# EAGLE schematic General IO (EAGLE 7.4.0)
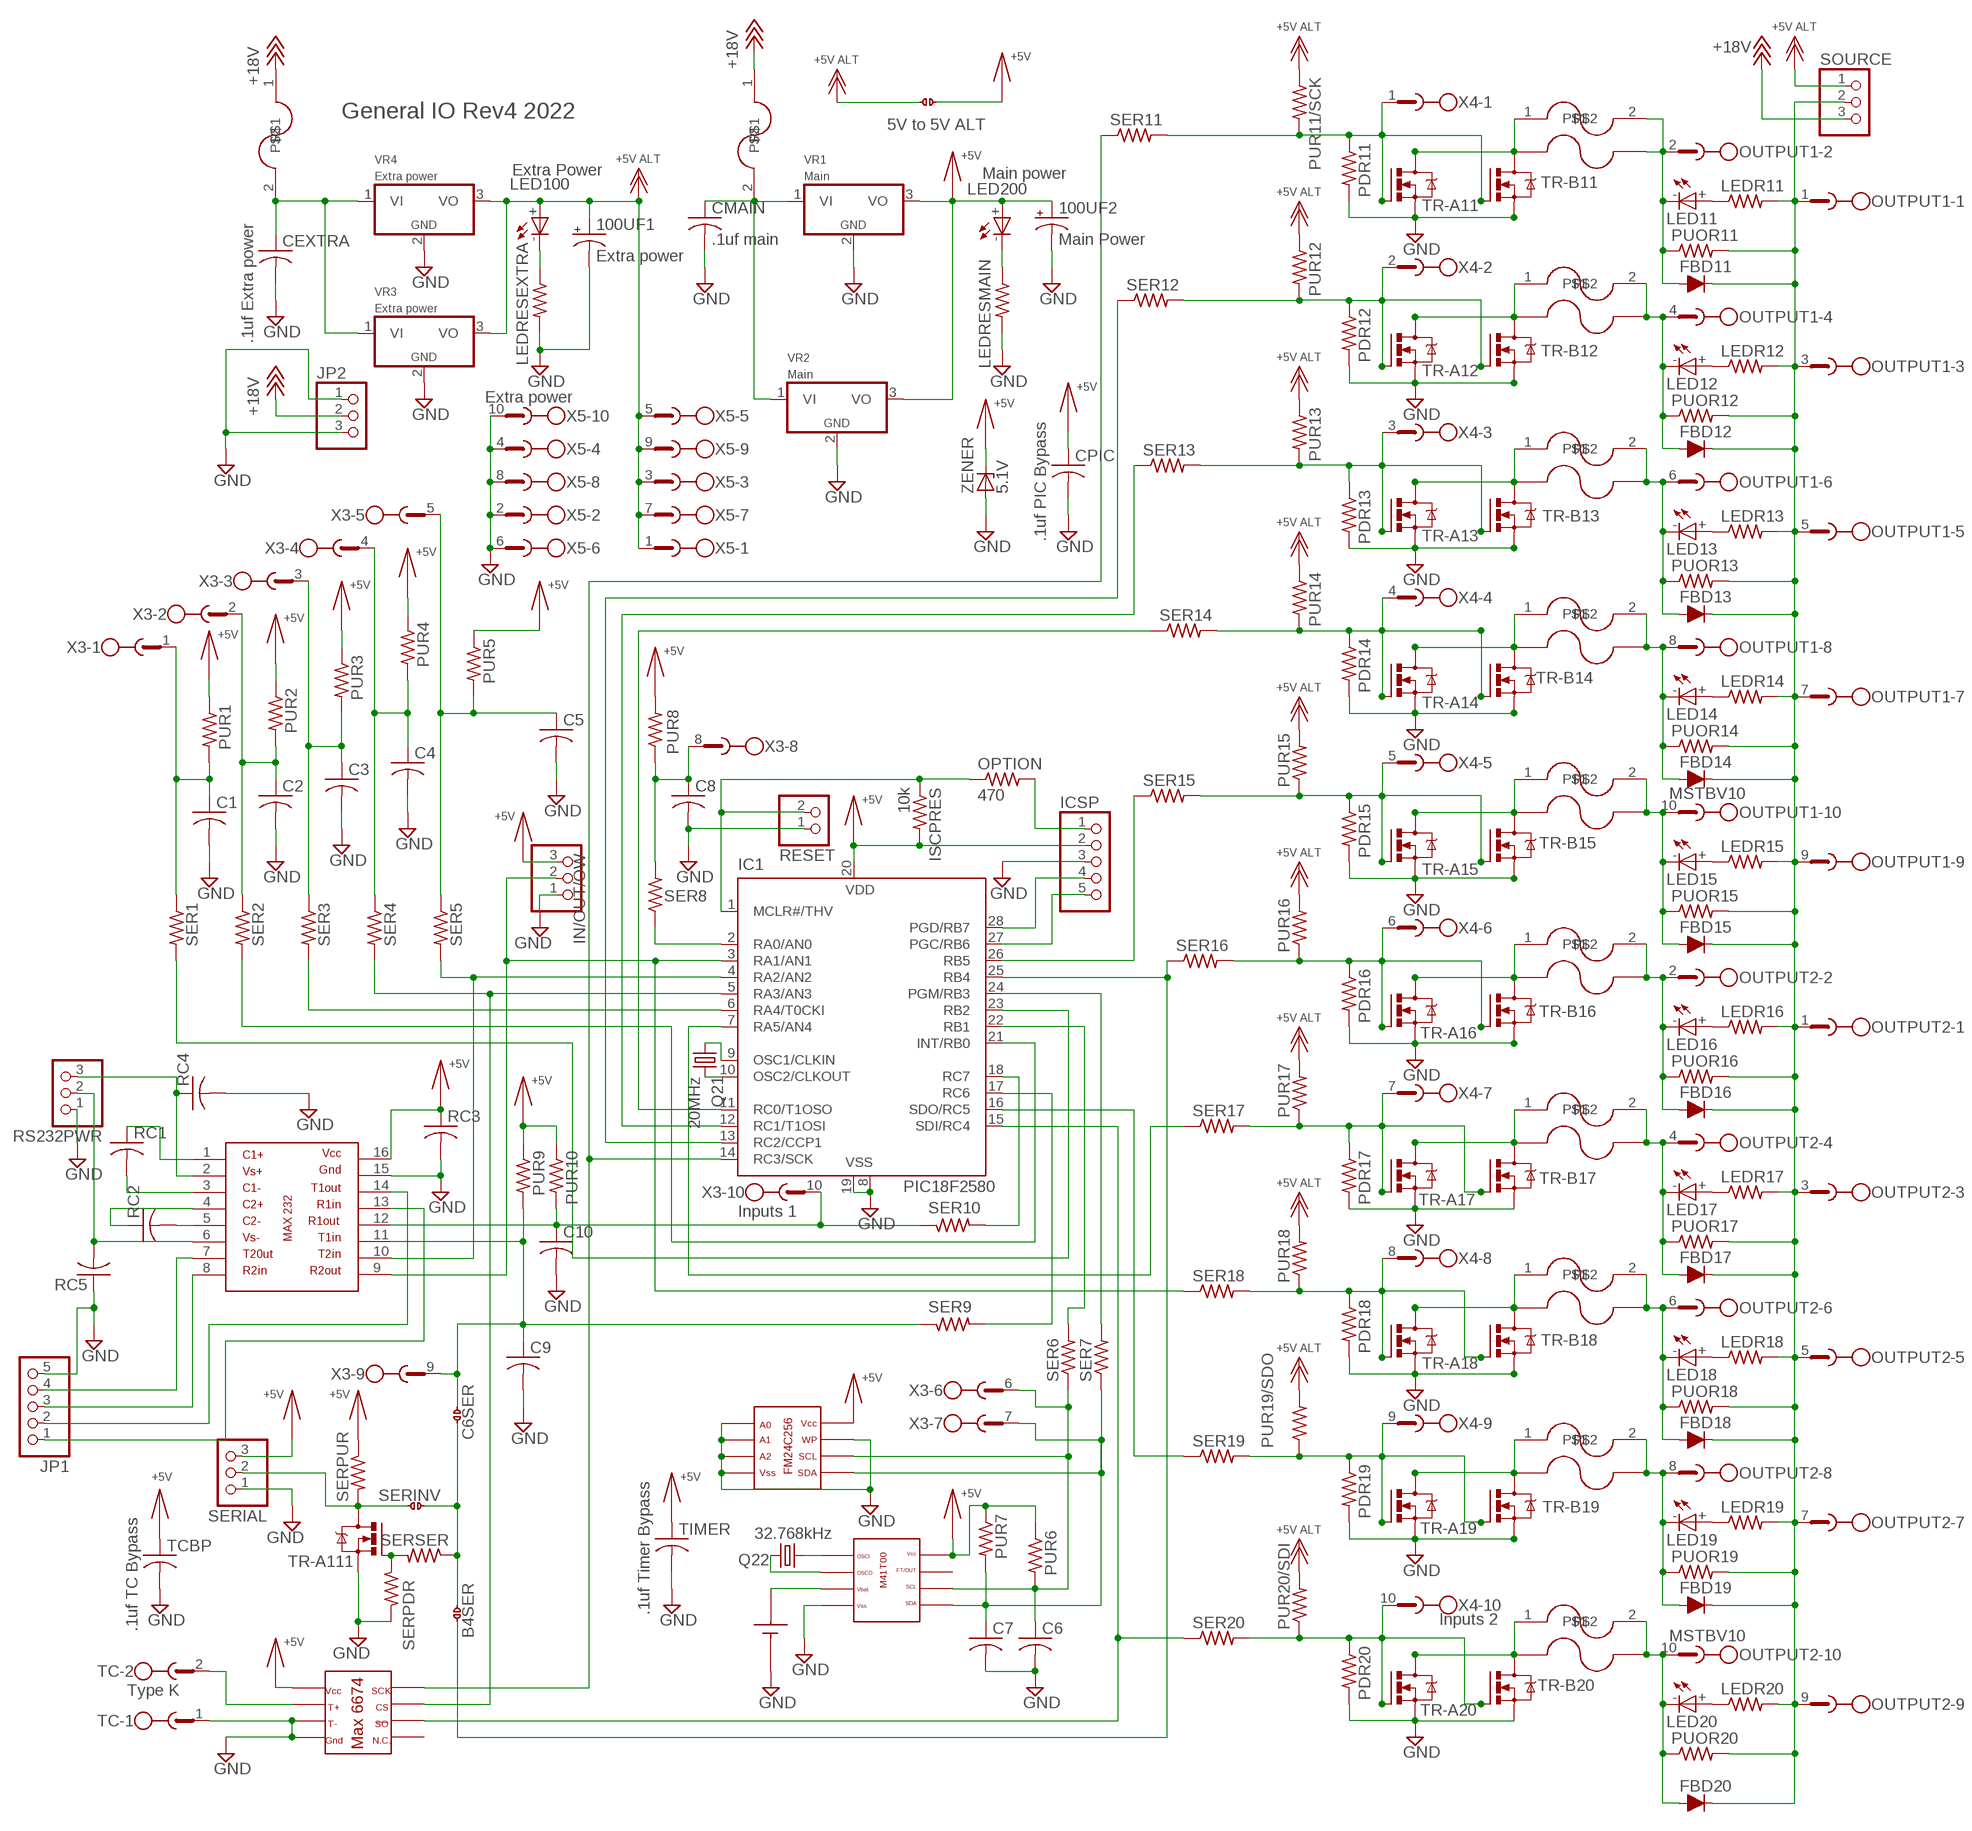
[diagram p0: schematic, sheet 1]

## Parts
100UF1  Extra power  CAPACITOR-ELECTROLYTICG  [PANASONIC_G]
100UF2  Main Power  CAPACITOR-ELECTROLYTICG  [PANASONIC_G]
BAT1  BH-401  [BH-401]
C1  CAPACITOR-NO-POLARITYC1210  [C1210]
C2  CAPACITOR-NO-POLARITYC1210  [C1210]
C3  CAPACITOR-NO-POLARITYC1210  [C1210]
C4  CAPACITOR-NO-POLARITYC1210  [C1210]
C5  CAPACITOR-NO-POLARITYC1210  [C1210]
C6  CAPACITOR-NO-POLARITYC1210  [C1210]
C6SER  SPLIT_PAD  [SPLIT_PAD]
C7  CAPACITOR-NO-POLARITYC1210  [C1210]
C8  CAPACITOR-NO-POLARITYC1210  [C1210]
C9  CAPACITOR-NO-POLARITYC1210  [C1210]
C10  CAPACITOR-NO-POLARITYC1210  [C1210]
CEXTRA  .1uf Extra power  CAPACITOR-NO-POLARITYC1210  [C1210]
CMAIN  .1uf main  CAPACITOR-NO-POLARITYC1210  [C1210]
CPIC  .1uf PIC Bypass  CAPACITOR-NO-POLARITYC1210  [C1210]
FBD11  D-FILL-SOD-87  [SOD87]
FBD12  D-FILL-SOD-87  [SOD87]
FBD13  D-FILL-SOD-87  [SOD87]
FBD14  D-FILL-SOD-87  [SOD87]
FBD15  D-FILL-SOD-87  [SOD87]
FBD16  D-FILL-SOD-87  [SOD87]
FBD17  D-FILL-SOD-87  [SOD87]
FBD18  D-FILL-SOD-87  [SOD87]
FBD19  D-FILL-SOD-87  [SOD87]
FBD20  D-FILL-SOD-87  [SOD87]
FUSE9  FUSE(SM)  [FUSE]
FUSE11  FUSE(SM)  [FUSE]
FUSE12  FUSE(SM)  [FUSE]
FUSE13  FUSE(SM)  [FUSE]
FUSE14  FUSE(SM)  [FUSE]
FUSE15  FUSE(SM)  [FUSE]
FUSE16  FUSE(SM)  [FUSE]
FUSE17  FUSE(SM)  [FUSE]
FUSE18  FUSE(SM)  [FUSE]
FUSE20  FUSE(SM)  [FUSE]
IC1  PIC18F2580  PIC16F876SO  [SO-28W]
ICSP  PINHD-1X5  [1X05]
IN/OUT/OW  PINHD-1X3  [1X03]
ISCPRES  10k  RESISITORM1406  [M1406]
JP1  PINHD-1X5  [1X05]
JP2  PINHD-1X3  [1X03]
LED11  LED  [1206]
LED12  LED  [1206]
LED13  LED  [1206]
LED14  LED  [1206]
LED15  LED  [1206]
LED16  LED  [1206]
LED17  LED  [1206]
LED18  LED  [1206]
LED19  LED  [1206]
LED20  LED  [1206]
LED100  Extra Power  LED  [1206]
LED200  Main power  LED  [1206]
LEDR11  RESISITORM1406  [M1406]
LEDR12  RESISITORM1406  [M1406]
LEDR13  RESISITORM1406  [M1406]
LEDR14  RESISITORM1406  [M1406]
LEDR15  RESISITORM1406  [M1406]
LEDR16  RESISITORM1406  [M1406]
LEDR17  RESISITORM1406  [M1406]
LEDR18  RESISITORM1406  [M1406]
LEDR19  RESISITORM1406  [M1406]
LEDR20  RESISITORM1406  [M1406]
LEDRESEXTRA  RESISITORR1210  [R1210]
LEDRESMAIN  RESISITORR1210  [R1210]
OPTION  470  RESISITORM1406  [M1406]
OUTPUT1  MSTBV10  [MSTBV10]
OUTPUT2  MSTBV10  [MSTBV10]
PDR11  RESISITORM1406  [M1406]
PDR12  RESISITORM1406  [M1406]
PDR13  RESISITORM1406  [M1406]
PDR14  RESISITORM1406  [M1406]
PDR15  RESISITORM1406  [M1406]
PDR16  RESISITORM1406  [M1406]
PDR17  RESISITORM1406  [M1406]
PDR18  RESISITORM1406  [M1406]
PDR19  RESISITORM1406  [M1406]
PDR20  RESISITORM1406  [M1406]
POLYFUSE11  POLYFUSE  [0204/5]
POLYFUSE12  POLYFUSE  [0204/5]
POLYFUSE13  POLYFUSE  [0204/5]
POLYFUSE14  POLYFUSE  [0204/5]
POLYFUSE15  POLYFUSE  [0204/5]
POLYFUSE16  POLYFUSE  [0204/5]
POLYFUSE17  POLYFUSE  [0204/5]
POLYFUSE18  POLYFUSE  [0204/5]
POLYFUSE19  POLYFUSE  [0204/5]
POLYFUSE20  POLYFUSE  [0204/5]
POLYFUSE100  Extra Power  POLYFUSE  [0204/5]
POLYFUSE200  Main power  POLYFUSE  [0204/5]
PUOR11  RESISITORM1406  [M1406]
PUOR12  RESISITORM1406  [M1406]
PUOR13  RESISITORM1406  [M1406]
PUOR14  RESISITORM1406  [M1406]
PUOR15  RESISITORM1406  [M1406]
PUOR16  RESISITORM1406  [M1406]
PUOR17  RESISITORM1406  [M1406]
PUOR18  RESISITORM1406  [M1406]
PUOR19  RESISITORM1406  [M1406]
PUOR20  RESISITORM1406  [M1406]
PUR1  RESISITORM1406  [M1406]
PUR2  RESISITORM1406  [M1406]
PUR3  RESISITORM1406  [M1406]
PUR4  RESISITORM1406  [M1406]
PUR5  RESISITORM1406  [M1406]
PUR6  RESISITORM1406  [M1406]
PUR7  RESISITORM1406  [M1406]
PUR8  RESISITORM1406  [M1406]
PUR9  RESISITORM1406  [M1406]
PUR10  RESISITORM1406  [M1406]
PUR11/SCK  RESISITORM1406  [M1406]
PUR12  RESISITORM1406  [M1406]
PUR13  RESISITORM1406  [M1406]
PUR14  RESISITORM1406  [M1406]
PUR15  RESISITORM1406  [M1406]
PUR16  RESISITORM1406  [M1406]
PUR17  RESISITORM1406  [M1406]
PUR18  RESISITORM1406  [M1406]
PUR19/SDO  RESISITORM1406  [M1406]
PUR20/SDI  RESISITORM1406  [M1406]
Q21  20MHz  CRYSTALSM49  [SM49]
Q22  32.768kHz  CRYSTALTC26H  [TC26H]
RC1  CAPACITOR-NO-POLARITYC1210  [C1210]
RC2  CAPACITOR-NO-POLARITYC1210  [C1210]
RC3  CAPACITOR-NO-POLARITYC1210  [C1210]
RC4  CAPACITOR-NO-POLARITYC1210  [C1210]
RC5  CAPACITOR-NO-POLARITYC1210  [C1210]
RESET  PINHD-1X2  [1X02]
RS232PWR  PINHD-1X3  [1X03]
SER1  RESISITORM1406  [M1406]
SER2  RESISITORM1406  [M1406]
SER3  RESISITORM1406  [M1406]
SER4  RESISITORM1406  [M1406]
SER5  RESISITORM1406  [M1406]
SER6  RESISITORM1406  [M1406]
SER7  RESISITORM1406  [M1406]
SER8  RESISITORM1406  [M1406]
SER9  RESISITORM1406  [M1406]
SER10  RESISITORM1406  [M1406]
SER11  RESISITORM1406  [M1406]
SER12  RESISITORM1406  [M1406]
SER13  RESISITORM1406  [M1406]
SER14  RESISITORM1406  [M1406]
SER15  RESISITORM1406  [M1406]
SER16  RESISITORM1406  [M1406]
SER17  RESISITORM1406  [M1406]
SER18  RESISITORM1406  [M1406]
SER19  RESISITORM1406  [M1406]
SER20  RESISITORM1406  [M1406]
SERIAL  PINHD-1X3  [1X03]
SERPDR  RESISITORM1406  [M1406]
SERPUR  RESISITORM1406  [M1406]
SERSER  RESISITORM1406  [M1406]
SOURCE  PINHD-1X3  [1X03]
TC  Type K  MST2V  [MSTBV2]
TCBP  .1uf TC Bypass  CAPACITOR-NO-POLARITYC1210  [C1210]
TIMER  .1uf Timer Bypass  CAPACITOR-NO-POLARITYC1210  [C1210]
TR-A11  ZXMN10A08GSOT223  [SOT223R_INFINEON]
TR-A12  ZXMN10A08GSOT223  [SOT223R_INFINEON]
TR-A13  ZXMN10A08GSOT223  [SOT223R_INFINEON]
TR-A14  ZXMN10A08GSOT223  [SOT223R_INFINEON]
TR-A15  ZXMN10A08GSOT223  [SOT223R_INFINEON]
TR-A16  ZXMN10A08GSOT223  [SOT223R_INFINEON]
TR-A17  ZXMN10A08GSOT223  [SOT223R_INFINEON]
TR-A18  ZXMN10A08GSOT223  [SOT223R_INFINEON]
TR-A19  ZXMN10A08GSOT223  [SOT223R_INFINEON]
TR-A20  ZXMN10A08GSOT223  [SOT223R_INFINEON]
TR-A111  ZXMN10A08GSOT223  [SOT223R_INFINEON]
TR-B11  ZXMN10A08G  [TO220BV]
TR-B12  ZXMN10A08G  [TO220BV]
TR-B13  ZXMN10A08G  [TO220BV]
TR-B14  ZXMN10A08G  [TO220BV]
TR-B15  ZXMN10A08G  [TO220BV]
TR-B16  ZXMN10A08G  [TO220BV]
TR-B17  ZXMN10A08G  [TO220BV]
TR-B18  ZXMN10A08G  [TO220BV]
TR-B19  ZXMN10A08G  [TO220BV]
TR-B20  ZXMN10A08G  [TO220BV]
U$1  MAX232  [SO16]
U$2  MAX6674  [SO08]
U$4  M41T00TIMER-I2C  [SO08]
U$18  FM24C256  [SO08]
U$21  SPLIT_PAD  [SPLIT_PAD]
U$23  SPLIT_PAD  [SPLIT_PAD]
U$24  SPLIT_PAD  [SPLIT_PAD]
VR1  Main  VOLTAGE-REGULATOR  [TO220S]
VR2  Main  VOLTAGE-REGULATORSO-223  [SOT223R_INFINEON]
VR3  Extra power  VOLTAGE-REGULATORSO-223  [SOT223R_INFINEON]
VR4  Extra power  VOLTAGE-REGULATOR  [TO220S]
X3  Inputs 1  MSTBV10  [MSTBV10]
X4  Inputs 2  MSTBV10  [MSTBV10]
X5  Extra power  MSTBV10  [MSTBV10]
ZENER  5.1V  ZENER-DIODESMB  [SMB]

## Nets
$N199: IC1.15(SDI/RC4) SER20.1 U$2.7
+5V: 100UF2.+ CPIC.1 IC1.20(VDD) ICSP.2 IN/OUT/OW.3 ISCPRES.2 LED200.+ PUR1.1 PUR2.1 PUR3.1 PUR4.1 PUR5.1 PUR6.1 PUR7.1 PUR8.2 PUR9.1 PUR10.1 RC3.1 SERIAL.3 SERPUR.1 TCBP.1 TIMER.1 U$1.16 U$2.4 U$4.8(VCC) U$18.8(VDD) U$21.P$1 VR1.3(VO) VR2.3(VO) ZENER.C
+18V: JP2.2 POLYFUSE100.1 POLYFUSE200.1 SOURCE.3
ALT5V: 100UF1.+ LED100.+ PUR11/SCK.1 PUR12.1 PUR13.1 PUR14.1 PUR15.2 PUR16.2 PUR17.2 PUR18.2 PUR19/SDO.2 PUR20/SDI.2 SOURCE.1 U$21.P$2 VR3.3(VO) VR4.3(VO) X5.1 X5.3 X5.5 X5.7 X5.9
GND: 100UF1.- 100UF2.- BAT1.P$2 C1.2 C2.2 C3.2 C4.2 C5.2 C6.2 C7.2 C8.2 C9.2 C10.2 CEXTRA.2 CMAIN.2 CPIC.2 IC1.8(VSS) IC1.19(VSS) ICSP.3 IN/OUT/OW.1 JP1.5 JP2.1 JP2.3 LEDRESEXTRA.2 LEDRESMAIN.2 PDR11.2 PDR12.2 PDR13.2 PDR14.2 PDR15.2 PDR16.2 PDR17.2 PDR18.2 PDR19.2 PDR20.2 RC3.2 RC4.2 RC5.1 RESET.1 RS232PWR.1 SERIAL.1 SERPDR.2 TC.1 TCBP.2 TIMER.2 TR-A11.3(S) TR-A12.3(S) TR-A13.3(S) TR-A14.3(S) TR-A15.3(S) TR-A16.3(S) TR-A17.3(S) TR-A18.3(S) TR-A19.3(S) TR-A20.3(S) TR-A111.3(S) TR-B11.S TR-B12.S TR-B13.S TR-B14.S TR-B15.S TR-B16.S TR-B17.S TR-B18.S TR-B19.S TR-B20.S U$1.15 U$2.1 U$2.2 U$4.4(VSS) U$18.1(A0) U$18.2(A1) U$18.3(A2) U$18.4(VSS) U$18.7(WP) VR1.2(GND) VR2.2(GND) VR3.2(GND) VR4.2(GND) X5.2 X5.4 X5.6 X5.8 X5.10 ZENER.A
N$1: FUSE17.P$1 POLYFUSE17.1 TR-A17.2(D) TR-B17.D
N$2: FUSE9.P$1 POLYFUSE19.1 TR-A19.2(D) TR-B19.D
N$3: PDR18.1 PUR18.1 SER18.2 TR-A18.1(G) TR-B18.G X4.8
N$4: FBD16.2(A) FUSE16.P$2 LED16.- OUTPUT2.2 POLYFUSE16.2 PUOR16.1
N$5: FBD17.2(A) FUSE17.P$2 LED17.- OUTPUT2.4 POLYFUSE17.2 PUOR17.1
N$6: FUSE16.P$1 POLYFUSE16.1 TR-A16.2(D) TR-B16.D
N$7: FUSE18.P$1 POLYFUSE18.1 TR-A18.2(D) TR-B18.D
N$8: IC1.7(RA5/AN4) SER17.1
N$9: FBD20.2(A) FUSE20.P$2 LED20.- OUTPUT2.10 POLYFUSE20.2 PUOR20.1
N$10: FBD18.2(A) FUSE18.P$2 LED18.- OUTPUT2.6 POLYFUSE18.2 PUOR18.1
N$11: IC1.16(SDO/RC5) SER19.1
N$12: IC1.2(RA0/AN0) SER8.1
N$13: FBD19.2(A) FUSE9.P$2 LED19.- OUTPUT2.8 POLYFUSE19.2 PUOR19.1
N$14: FUSE20.P$1 POLYFUSE20.1 TR-A20.2(D) TR-B20.D
N$15: IC1.21(INT/RB0) SER2.2
N$16: FBD12.2(A) FUSE12.P$2 LED12.- OUTPUT1.4 POLYFUSE12.2 PUOR12.1
N$17: FUSE15.P$1 POLYFUSE15.1 TR-A15.2(D) TR-B15.D
N$18: FBD15.2(A) FUSE15.P$2 LED15.- OUTPUT1.10 POLYFUSE15.2 PUOR15.1
N$19: JP1.4 U$1.7
N$20: PDR17.1 PUR17.1 SER17.2 TR-A17.1(G) TR-B17.G X4.7
N$21: FUSE14.P$1 POLYFUSE14.1 TR-A14.2(D) TR-B14.D
N$22: FBD14.2(A) FUSE14.P$2 LED14.- OUTPUT1.8 POLYFUSE14.2 PUOR14.1
N$23: FUSE13.P$1 POLYFUSE13.1 TR-A13.2(D) TR-B13.D
N$24: FBD13.2(A) FUSE13.P$2 LED13.- OUTPUT1.6 POLYFUSE13.2 PUOR13.1
N$25: PDR15.1 PUR15.1 SER15.2 TR-A15.1(G) TR-B15.G X4.5
N$26: PDR13.1 PUR13.2 SER13.2 TR-A13.1(G) TR-B13.G X4.3
N$27: FUSE12.P$1 POLYFUSE12.1 TR-A12.2(D) TR-B12.D
N$28: PDR14.1 PUR14.2 SER14.2 TR-A14.1(G) TR-B14.G X4.4
N$29: FUSE11.P$1 POLYFUSE11.1 TR-A11.2(D) TR-B11.D
N$30: FBD11.2(A) FUSE11.P$2 LED11.- OUTPUT1.2 POLYFUSE11.2 PUOR11.1
N$31: IC1.28(PGD/RB7) ICSP.4
N$32: PDR16.1 PUR16.1 SER16.2 TR-A16.1(G) TR-B16.G X4.6
N$33: IC1.23(RB2) SER1.2
N$34: ICSP.1 OPTION.2
N$35: IC1.10(OSC2/CLKOUT) Q21.2
N$36: SERPDR.1 SERSER.2 TR-A111.1(G)
N$37: IC1.1(MCLR#/THV) ISCPRES.1 OPTION.1 RESET.2
N$38: SERIAL.2 SERPUR.2 TR-A111.2(D) U$23.P$1
N$39: IC1.9(OSC1/CLKIN) Q21.1
N$40: IC1.27(PGC/RB6) ICSP.5
N$41: C10.1 PUR10.2 SER10.1 U$1.12 X3.10
N$43: IC1.4(RA2/AN2) SER5.2 U$1.10
N$44: C6SER.P$1 C9.1 PUR9.2 SER9.1 U$1.11 X3.9
N$45: JP1.3 U$1.8
N$46: TC.2 U$2.3
N$47: CEXTRA.1 POLYFUSE100.2 VR3.1(VI) VR4.1(VI)
N$48: C2.1 PUR2.2 SER2.1 X3.2
N$49: JP1.2 U$1.14
N$51: C4.1 PUR4.2 SER4.1 X3.4
N$52: FBD11.1(C) FBD12.1(C) FBD13.1(C) FBD14.1(C) FBD15.1(C) FBD16.1(C) FBD17.1(C) FBD18.1(C) FBD19.1(C) FBD20.1(C) LEDR11.2 LEDR12.2 LEDR13.2 LEDR14.2 LEDR15.2 LEDR16.2 LEDR17.2 LEDR18.2 LEDR19.2 LEDR20.2 OUTPUT1.1 OUTPUT1.3 OUTPUT1.5 OUTPUT1.7 OUTPUT1.9 OUTPUT2.1 OUTPUT2.3 OUTPUT2.5 OUTPUT2.7 OUTPUT2.9 PUOR11.2 PUOR12.2 PUOR13.2 PUOR14.2 PUOR15.2 PUOR16.2 PUOR17.2 PUOR18.2 PUOR19.2 PUOR20.2 SOURCE.2
N$53: Q22.1 U$4.2(OSCO)
N$54: Q22.2 U$4.1(OSCI)
N$55: LED200.- LEDRESMAIN.1
N$56: BAT1.P$1 U$4.3(VBAT)
N$57: IC1.22(RB1) SER6.2
N$58: PDR11.1 PUR11/SCK.2 SER11.2 TR-A11.1(G) TR-B11.G X4.1
N$59: IC1.24(PGM/RB3) SER7.2
N$60: JP1.1 U$1.13
N$61: C8.1 PUR8.1 SER8.2 X3.8
N$62: IC1.18(RC7) SER10.2
N$63: CMAIN.1 POLYFUSE200.2 VR1.1(VI) VR2.1(VI)
N$64: LED20.+ LEDR20.1
N$65: LED19.+ LEDR19.1
N$66: LED100.- LEDRESEXTRA.1
N$67: LED18.+ LEDR18.1
N$68: IC1.17(RC6) SER9.2
N$69: LED17.+ LEDR17.1
N$70: LED16.+ LEDR16.1
N$71: LED15.+ LEDR15.1
N$72: LED14.+ LEDR14.1
N$73: LED13.+ LEDR13.1
N$74: LED12.+ LEDR12.1
N$75: LED11.+ LEDR11.1
N$76: PDR12.1 PUR12.2 SER12.2 TR-A12.1(G) TR-B12.G X4.2
N$77: C3.1 PUR3.2 SER3.1 X3.3
N$78: PDR19.1 PUR19/SDO.1 SER19.2 TR-A19.1(G) TR-B19.G X4.9
N$79: PDR20.1 PUR20/SDI.1 SER20.2 TR-A20.1(G) TR-B20.G X4.10
N$80: RC2.2 U$1.5
N$81: RC1.2 U$1.3
N$82: RC2.1 U$1.4
N$83: RC1.1 U$1.1
N$84: RC4.1 RS232PWR.3 U$1.2
N$85: RC5.2 RS232PWR.2 U$1.6
N$87: C5.1 PUR5.2 SER5.1 X3.5
N$89: C1.1 PUR1.2 SER1.1 X3.1
N$90: IC1.14(RC3/SCK) SER11.1 U$2.5
N$93: IC1.13(RC2/CCP1) SER12.1
N$94: IC1.12(RC1/T1OSI) SER13.1
N$95: IC1.5(RA3/AN3) SER4.2 U$2.6
N$97: IC1.6(RA4/T0CKI) SER3.2
N$98: IC1.11(RC0/T1OSO) SER14.1
N$99: IC1.25(RB4) SER16.1 U$24.P$2
N$101: IC1.26(RB5) SER15.1
N$104: C6SER.P$2 SERSER.1 U$23.P$2 U$24.P$1
N$107: C6.1 PUR6.2 SER6.1 U$4.6(SCL) U$18.6(SCL) X3.6
N$111: C7.1 PUR7.2 SER7.1 U$4.5(SDA) U$18.5(SDA) X3.7
SER18: IC1.3(RA1/AN1) IN/OUT/OW.2 SER18.1 U$1.9
Unconnected: U$2.8 U$4.7(FT/OUT)

## Notes on the sheet
- General IO Rev4 2022 | 5V to 5V ALT
- C6SER
- SERINV
- B4SER

## Library data of the parts
100UF1 100UF2 = 1 Dan's Common Parts:CAPACITOR-ELECTROLYTIC: POLARIZED CAPACITOR, American symbol
BAT1 = 1 Dan's Common Parts:BH-401
C1-C10 CEXTRA CMAIN CPIC RC1-RC5 TCBP TIMER = 1 Dan's Common Parts:CAPACITOR-NO-POLARITY: CAPACITOR, American symbol
C6SER U$21 U$23 U$24 = 1 Dan's Common Parts:SPLIT_PAD
FBD11-FBD20 = semicon-smd-ipc:D-FILL-: DIODE filled
FUSE9 FUSE11-FUSE18 FUSE20 = 1 Dan's Common Parts:FUSE(SM)
IC1 = 1 Dan's Common Parts:PIC16*876: MICROCONTROLLER flash type
ICSP JP1 = pinhead:PINHD-1X5: PIN HEADER
IN/OUT/OW JP2 RS232PWR SERIAL SOURCE = pinhead:PINHD-1X3: PIN HEADER
ISCPRES LEDR11-LEDR20 LEDRESEXTRA LEDRESMAIN OPTION PDR11-PDR20 PUOR11-PUOR20 PUR1-PUR10 PUR11/SCK PUR12-PUR18 PUR19/SDO PUR20/SDI SER1-SER20 SERPDR SERPUR SERSER = 1 Dan's Common Parts:RESISITOR: RESISTOR, American symbol
LED11-LED20 LED100 LED200 = 1 Dan's Common Parts:LED
OUTPUT1 OUTPUT2 X3-X5 = con-phoenix-508:MSTBV10: PHOENIX
POLYFUSE11-POLYFUSE20 POLYFUSE100 POLYFUSE200 = 1 Dan's Common Parts:POLYFUSE
Q21 Q22 = 1 Dan's Common Parts:CRYSTAL: CRYSTAL
RESET = pinhead:PINHD-1X2: PIN HEADER
TC = con-phoenix-508:MST2V: PHOENIX
TR-A11-TR-A20 TR-A111 TR-B11-TR-B20 = 1 Dan's Common Parts:ZXMN10A08G: N-CHANNEL MOS FET
U$1 = 1 Dan's Common Parts:MAX232
U$2 = 1 Dan's Common Parts:MAX6674
U$4 = 1 Dan's Common Parts:M41T00TIMER-I2C
U$18 = 1 Dan's Common Parts:FM24C256
VR1-VR4 = 1 Dan's Common Parts:VOLTAGE-REGULATOR: Positive VOLTAGE REGULATOR Source: http://cache.national.com/ds/LM/LM78L05.pdf http://www.fairchildsemi.com/ds/LM/LM7805.pdf
ZENER = 1 Dan's Common Parts:ZENER-DIODE: Z-Diode